# EAGLE board Controller Board (EAGLE 8.5.1), part 1 of 2
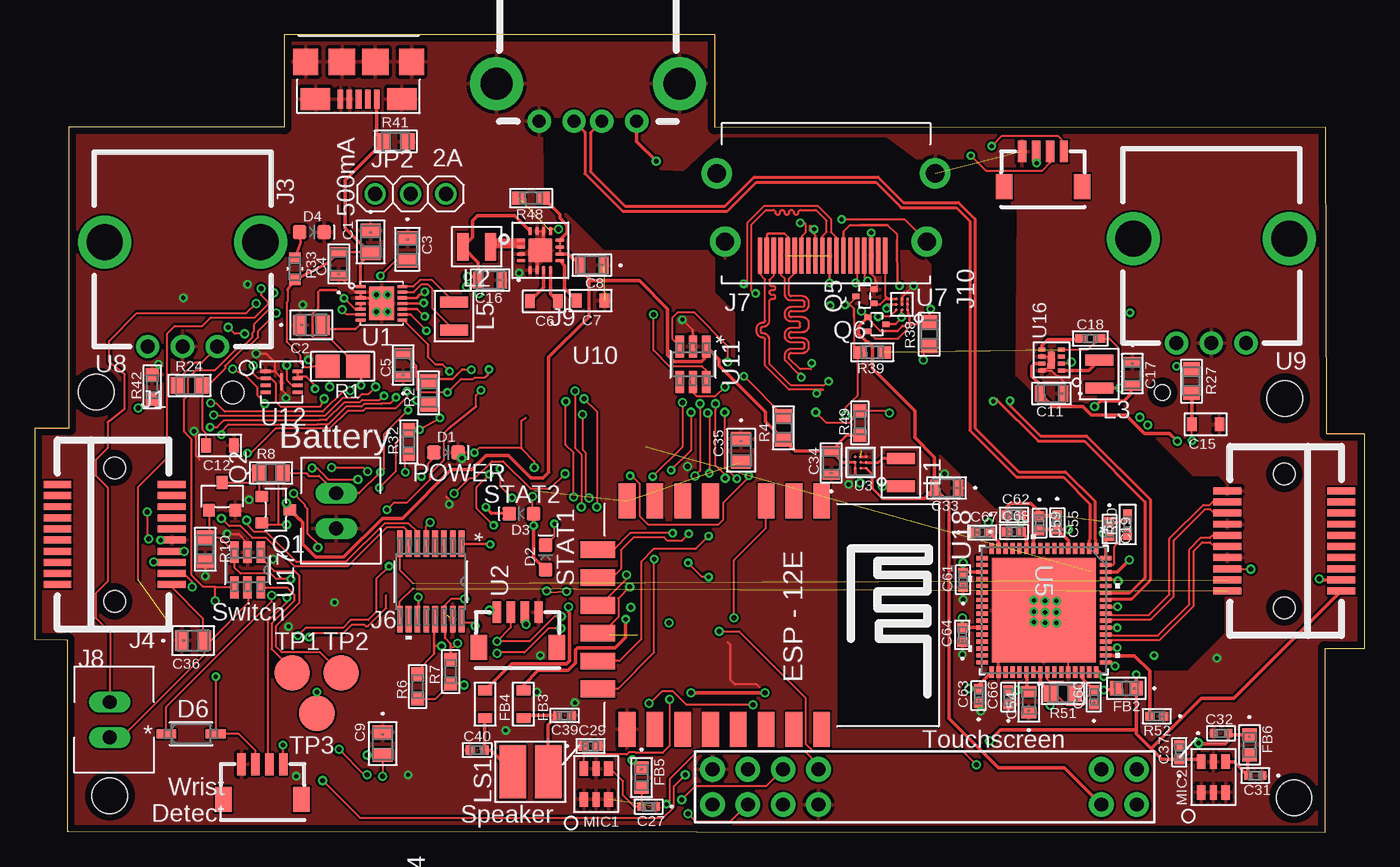
[diagram p6: board, top side]
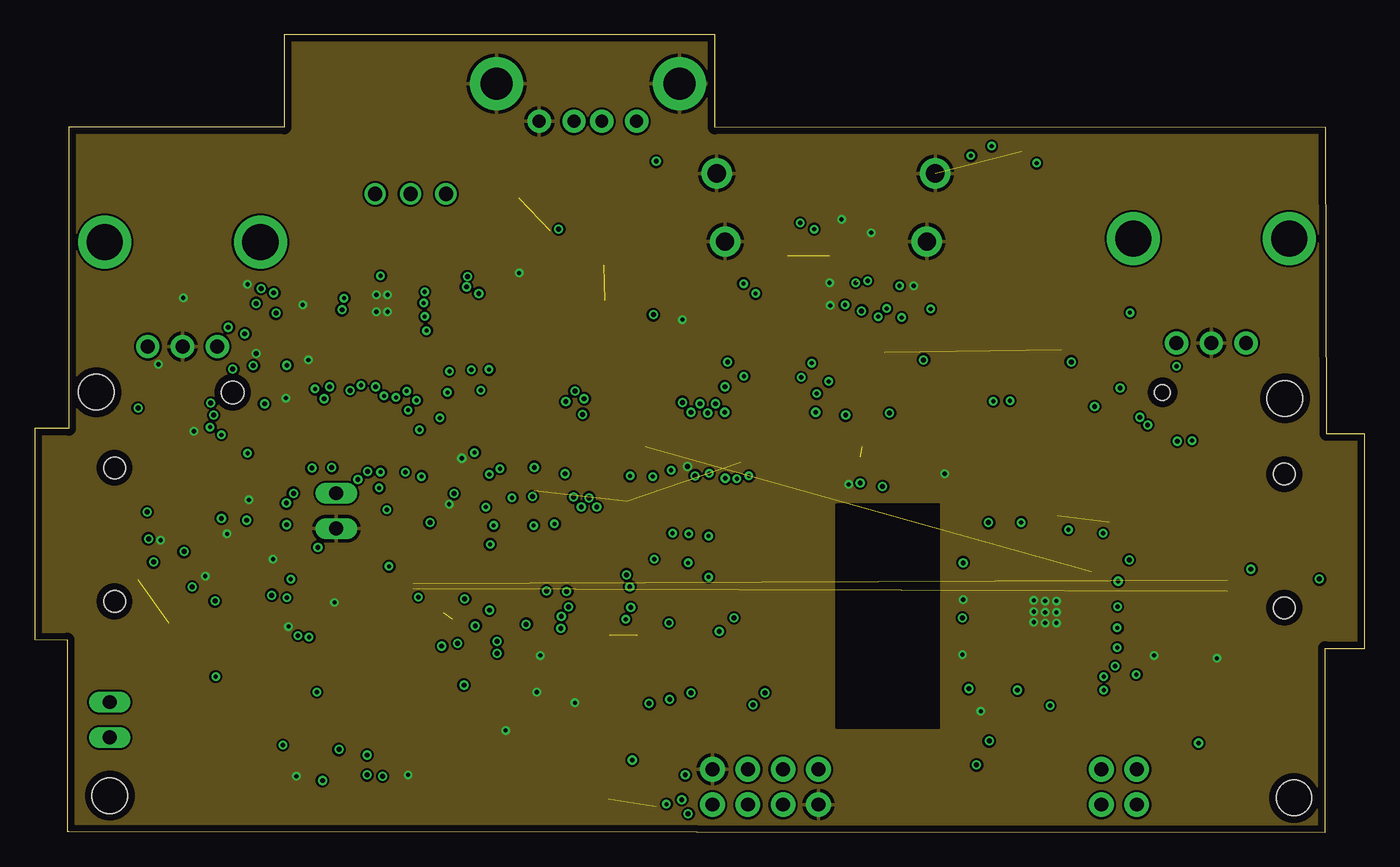
[diagram p7: board, inner layer Route2]
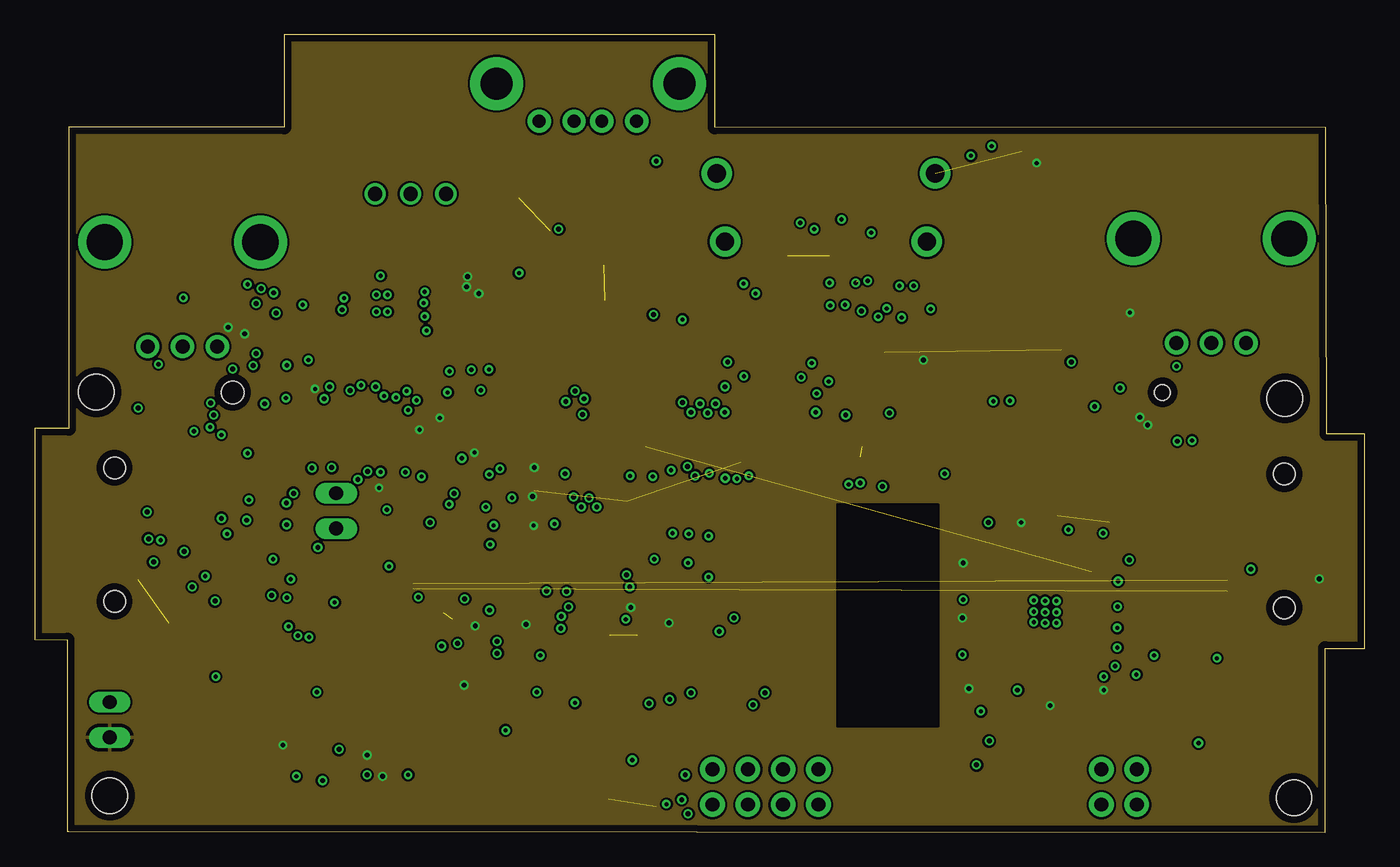
[diagram p8: board, inner layer Route15]
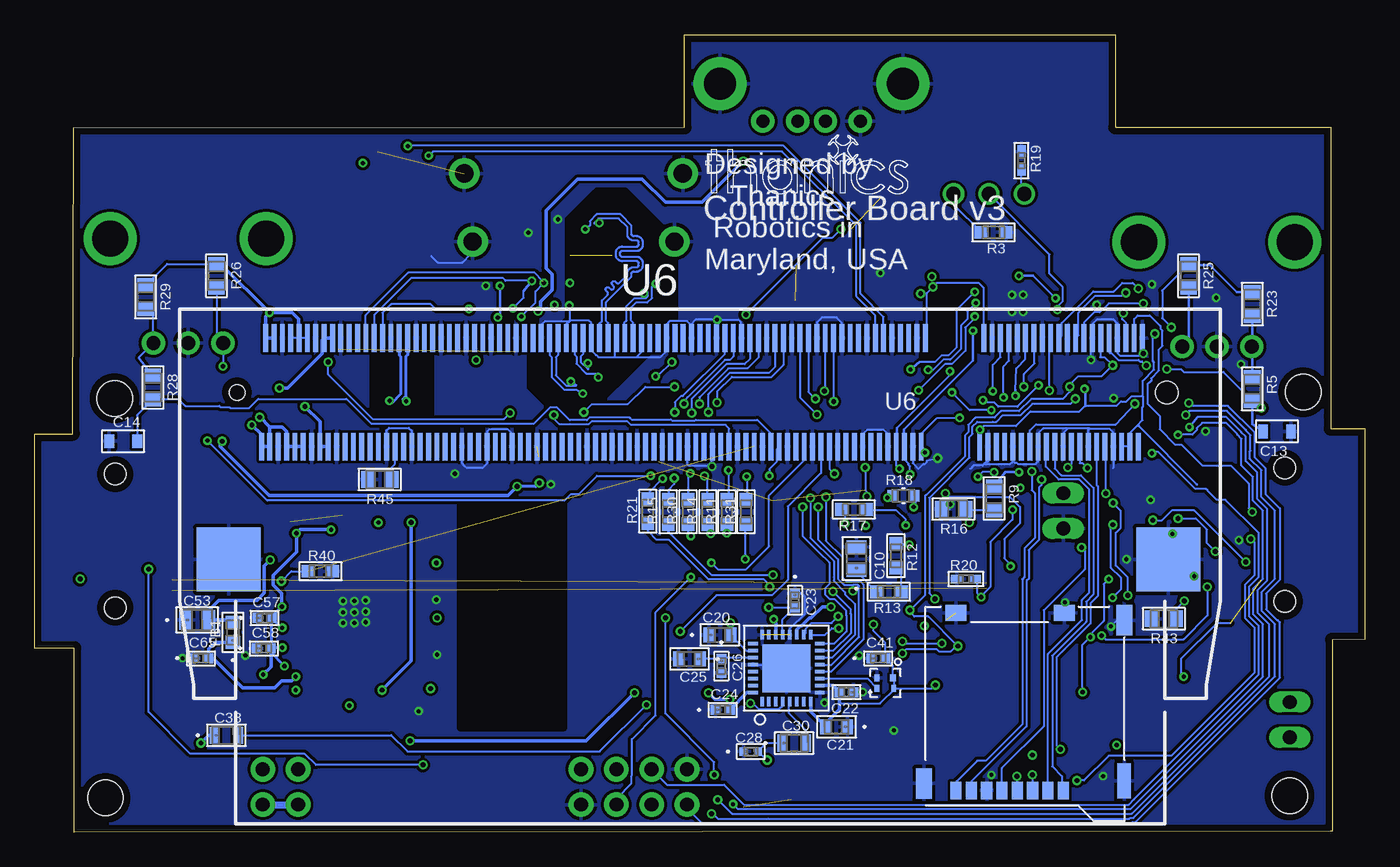
[diagram p9: board, bottom side, seen from below]

Size 95.55 x 57.3 mm. Coordinates in mm from the lower left corner, seen from the top.
Outline: 2.45,0.08 92.71,0 92.71,13.21 95.55,13.21 95.55,28.63 92.81,28.63 92.76,50.62 48.87,50.65 48.87,57.3 17.93,57.3 17.93,50.65 2.45,50.65 2.44,29.87 2.44,29.01 0,29.01 0,13.84 2.34,13.82 2.34,0.08 2.45,0.08
Copper layers (1*2*15*16): Top 0.035mm / dielectric 0.2mm / Route2 0.035mm / dielectric 1.2mm / Route15 0.035mm / dielectric 0.2mm / Bottom 0.035mm
Design rules "Elecrow_4-layer_PCB_eagle_rule *": minimum track width 6mil, minimum drill 12mil, track to track 6mil, track to pad 6mil, pad to pad 6mil, via to via 8mil, smd to smd 0mil, copper to edge 20mil, drill to drill 10mil, minimum pad ring 6mil, minimum via ring 6mil, stop-mask expansion 0mil, vias tented up to drill 100mil, thermal gap 10mil
Holes 2.54 mm at 90.47,2.46 5.38,2.62 89.81,31.17 4.42,31.62

## Footprints (pad centres in the part's own frame; a part is rotated, then mirrored left to right if it is on the bottom)
0805 = smd 0.965 x 1.448: 1 -0.826,0; 2 0.826,0
YAG_CC0805 = smd 0.965 x 1.448: 1 -0.826,0; 2 0.826,0
G-21 = smd 0.711 x 1.245: 1 -0.851,0; 2 0.851,0
0603_CAPACITOR = smd 0.701 x 1.001: 1 -1.001,0; 2 1.001,0
CC0402N-M = smd 0.864 x 0.61: 1 -0.635,0; 2 0.635,0
0402-M = smd 0.711 x 0.711: 1 -0.508,0; 2 0.508,0
0603-M = smd 0.813 x 1.067: 1 -0.775,0; 2 0.775,0
G-155-M = smd 0.559 x 0.61: 1 -0.521,0; 2 0.521,0
YAG_CC0402-M = smd 0.61 x 0.66: 1 -0.521,0; 2 0.521,0
LED-0603 = smd 1 x 1: A -0.877,0; C 0.877,0
SOD123-M = smd 1.416 x 0.652: A 1.776,0; C -1.776,0
IND_BLM18_0603-M = smd 0.914 x 1.041: 1 -0.724,0; 2 0.724,0
JST_SH_4POS = smd 0.6 x 1.55: 1 -1.5,0; 2 -0.5,0; 3 0.5,0; 4 1.5,0 | smd 1.2 x 1.8: P$5 -2.8,2.525; P$6 2.8,2.525
3.5_TOUCHSCREEN = drill 1 pad 1.778: 1 -12.7,1.27; 2 -10.16,1.27; 3 10.16,1.27; 4 12.7,1.27; 5 15.24,1.27; 6 17.78,1.27; 7 17.78,-1.27; 8 15.24,-1.27; 9 12.7,-1.27; 10 10.16,-1.27; 11 -10.16,-1.27; 12 -12.7,-1.27
USB_MICRO_B_SMT = smd 0.4 x 1.35: 1 -1.3,0; 2 -0.65,0; 3 0,0; 4 0.65,0; 5 1.3,0 | smd 1.9 x 1.9: 6 -1.2,-2.68; 7 1.2,-2.68 | smd 2.1 x 1.6: P$1 -3.1,0; P$2 3.1,0 | smd 1.8 x 1.9: P$3 3.8,-2.68; P$4 -3.8,-2.68
EDGE_CONNECTOR_20POS = smd 0.5 x 2: 1 -3.6,0; 2 -2.8,0; 3 -2,0; 4 -1.2,0; 5 -0.4,0; 6 0.4,0; 7 1.2,0; 8 2,0; 9 2.8,0; 10 3.6,0; 11 3.6,8.2; 12 2.8,8.2; 13 2,8.2; 14 1.2,8.2; 15 0.4,8.2; 16 -0.4,8.2; 17 -1.2,8.2; 18 -2,8.2; 19 -2.8,8.2; 20 -3.6,8.2 | hole 1.55: -4.8,4.1; 4.8,4.1
XH_CONNECTOR = drill 1.001 long: 1 -1.27,0; 2 1.27,0
HDMI = smd 0.3 x 2.6: 1 4.75,4; 2 4.25,4; 3 3.75,4; 4 3.25,4; 5 2.75,4; 6 2.25,4; 7 1.75,4; 8 1.25,4; 9 0.75,4; 10 0.25,4; 11 -0.25,4; 12 -0.75,4; 13 -1.25,4; 14 -1.75,4; 15 -2.25,4; 16 -2.75,4; 17 -3.25,4; 18 -3.75,4; 19 -4.25,4 | drill 1.3 pad 2.184: P$1 7.25,3; P$2 -7.25,3; P$3 -7.85,-1.9; P$4 7.85,-1.9
USB_A_RECEPT = drill 0.92 pad 1.676: 1 -3.5,0; 2 -1,0; 3 1,0; 4 3.5,0 | drill 2.3 pad 3.81: 5 -6.57,-2.71; 6 6.57,-2.71
1X03 = drill 1.016: 1 -2.54,0; 2 0,0; 3 2.54,0
1008 = smd 0.8 x 2: P$1 -1,0; P$2 1,0
470NH_INDUCTOR = smd 0.8 x 2: P$1 -1,0; P$2 1,0
SPEAKER = smd 1.905 x 3.81: 1 -1.27,0.889; 2 1.27,0.889
SISONIC_MICROPHONE = smd 1.032 x 0.622: 1 -1.104,0.884; 3 -1.104,-0.884; 4 1.104,-0.884; 6 1.104,0.884 | smd 1.032 x 0.5: 2 -1.104,0; 5 1.104,0
SOT-23_(TO-236AB) = smd 0.8 x 0.9: D 0,-1; G 0.95,1; S -0.95,1
SOT-523 = smd 0.4 x 0.51: D 0,0.65; G -0.5,-0.65; S 0.5,-0.65
1206 = smd 1.727 x 1.676: 1 -1.092,0; 2 1.092,0
RC0805N = smd 1.006 x 1.2: 1 -0.853,0; 2 0.853,0
RC0603N-M = smd 0.965 x 0.914: 1 -0.876,0; 2 0.876,0
RC0603N = smd 0.762 x 0.813: 1 -0.775,0; 2 0.775,0
RC0402N-M = smd 0.864 x 0.61: 1 -0.66,0; 2 0.66,0
YAG_R0402-M = smd 0.66 x 0.66: 1 -0.508,0; 2 0.508,0
B2,54 = smd 2.54 x 2.54: TP 0,0
AAT3620_TDFN = smd 0.7 x 0.22: 1 -1.5,1.2; 2 -1.5,0.8; 3 -1.5,0.4; 4 -1.5,0; 5 -1.5,-0.4; 6 -1.5,-0.8; 7 -1.5,-1.2; 8 1.5,-1.2; 9 1.5,-0.8; 10 1.5,-0.4; 11 1.5,0; 12 1.5,0.4; 13 1.5,0.8; 14 1.5,1.2 | smd 1.8 x 2.4: EP 0,0
21-0055H_16-M = smd 1.905 x 0.406: 1 -2.705,2.223; 2 -2.705,1.587; 3 -2.705,0.953; 4 -2.705,0.318; 5 -2.705,-0.318; 6 -2.705,-0.953; 7 -2.705,-1.587; 8 -2.705,-2.223; 9 2.705,-2.223; 10 2.705,-1.587; 11 2.705,-0.953; 12 2.705,-0.318; 13 2.705,0.318; 14 2.705,0.953; 15 2.705,1.587; 16 2.705,2.223
YFF9 = smd 0.23 x 0.23: A1 -0.4,0.4; A2 0,0.4; A3 0.4,0.4; B1 -0.4,0; B2 0,0; B3 0.4,0; C1 -0.4,-0.4; C2 0,-0.4; C3 0.4,-0.4
QFN64_9X9MC-M = smd 0.813 x 0.305: 1 -4.445,3.75; 2 -4.445,3.25; 3 -4.445,2.75; 4 -4.445,2.25; 5 -4.445,1.75; 6 -4.445,1.25; 7 -4.445,0.75; 8 -4.445,0.25; 9 -4.445,-0.25; 10 -4.445,-0.75; 11 -4.445,-1.25; 12 -4.445,-1.75; 13 -4.445,-2.25; 14 -4.445,-2.75; 15 -4.445,-3.25; 16 -4.445,-3.75; 33 4.445,-3.75; 34 4.445,-3.25; 35 4.445,-2.75; 36 4.445,-2.25; 37 4.445,-1.75; 38 4.445,-1.25; 39 4.445,-0.75; 40 4.445,-0.25; 41 4.445,0.25; 42 4.445,0.75; 43 4.445,1.25; 44 4.445,1.75; 45 4.445,2.25; 46 4.445,2.75; 47 4.445,3.25; 48 4.445,3.75 | smd 0.305 x 0.813: 17 -3.75,-4.445; 18 -3.25,-4.445; 19 -2.75,-4.445; 20 -2.25,-4.445; 21 -1.75,-4.445; 22 -1.25,-4.445; 23 -0.75,-4.445; 24 -0.25,-4.445; 25 0.25,-4.445; 26 0.75,-4.445; 27 1.25,-4.445; 28 1.75,-4.445; 29 2.25,-4.445; 30 2.75,-4.445; 31 3.25,-4.445; 32 3.75,-4.445; 49 3.75,4.445; 50 3.25,4.445; 51 2.75,4.445; 52 2.25,4.445; 53 1.75,4.445; 54 1.25,4.445; 55 0.75,4.445; 56 0.25,4.445; 57 -0.25,4.445; 58 -0.75,4.445; 59 -1.25,4.445; 60 -1.75,4.445; 61 -2.25,4.445; 62 -2.75,4.445; 63 -3.25,4.445; 64 -3.75,4.445 | smd 7.493 x 7.493: 65 0,0
SO-DIMM = smd 0.35 x 2: 1 -26.4,-3.9; 2 -26.1,3.9; 3 -25.8,-3.9; 4 -25.5,3.9; 5 -25.2,-3.9; 6 -24.9,3.9; 7 -24.6,-3.9; 8 -24.3,3.9; 9 -24,-3.9; 10 -23.7,3.9; 11 -23.4,-3.9; 12 -23.1,3.9; 13 -22.8,-3.9; 14 -22.5,3.9; 15 -22.2,-3.9; 16 -21.9,3.9; 17 -21.6,-3.9; 18 -21.3,3.9; 19 -21,-3.9; 20 -20.7,3.9; 21 -20.4,-3.9; 22 -20.1,3.9; 23 -19.8,-3.9; 24 -19.5,3.9; 25 -19.2,-3.9; 26 -18.9,3.9; 27 -18.6,-3.9; 28 -18.3,3.9; 29 -18,-3.9; 30 -17.7,3.9; 31 -17.4,-3.9; 32 -17.1,3.9; 33 -16.8,-3.9; 34 -16.5,3.9; 35 -16.2,-3.9; 36 -15.9,3.9; 37 -15.6,-3.9; 38 -15.3,3.9; 39 -15,-3.9; 40 -14.7,3.9; 41 -10.8,-3.9; 42 -10.5,3.9; 43 -10.2,-3.9; 44 -9.9,3.9; 45 -9.6,-3.9; 46 -9.3,3.9; 47 -9,-3.9; 48 -8.7,3.9; 49 -8.4,-3.9; 50 -8.1,3.9; 51 -7.8,-3.9; 52 -7.5,3.9; 53 -7.2,-3.9; 54 -6.9,3.9; 55 -6.6,-3.9; 56 -6.3,3.9; 57 -6,-3.9; 58 -5.7,3.9; 59 -5.4,-3.9; 60 -5.1,3.9; 61 -4.8,-3.9; 62 -4.5,3.9; 63 -4.2,-3.9; 64 -3.9,3.9; 65 -3.6,-3.9; 66 -3.3,3.9; 67 -3,-3.9; 68 -2.7,3.9; 69 -2.4,-3.9; 70 -2.1,3.9; 71 -1.8,-3.9; 72 -1.5,3.9; 73 -1.2,-3.9; 74 -0.9,3.9; 75 -0.6,-3.9; 76 -0.3,3.9; 77 0,-3.9; 78 0.3,3.9; 79 0.6,-3.9; 80 0.9,3.9; 81 1.2,-3.9; 82 1.5,3.9; 83 1.8,-3.9; 84 2.1,3.9; 85 2.4,-3.9; 86 2.7,3.9; 87 3,-3.9; 88 3.3,3.9; 89 3.6,-3.9; 90 3.9,3.9; 91 4.2,-3.9; 92 4.5,3.9; 93 4.8,-3.9; 94 5.1,3.9; 95 5.4,-3.9; 96 5.7,3.9; 97 6,-3.9; 98 6.3,3.9; 99 6.6,-3.9; 100 6.9,3.9; 101 7.2,-3.9; 102 7.5,3.9; 103 7.8,-3.9; 104 8.1,3.9; 105 8.4,-3.9; 106 8.7,3.9; 107 9,-3.9; 108 9.3,3.9; 109 9.6,-3.9; 110 9.9,3.9; 111 10.2,-3.9; 112 10.5,3.9; 113 10.8,-3.9; 114 11.1,3.9; 115 11.4,-3.9; 116 11.7,3.9; 117 12,-3.9; 118 12.3,3.9; 119 12.6,-3.9; 120 12.9,3.9; 121 13.2,-3.9; 122 13.5,3.9; 123 13.8,-3.9; 124 14.1,3.9; 125 14.4,-3.9; 126 14.7,3.9; 127 15,-3.9; 128 15.3,3.9; 129 15.6,-3.9; 130 15.9,3.9; 131 16.2,-3.9; 132 16.5,3.9; 133 16.8,-3.9; 134 17.1,3.9; 135 17.4,-3.9; 136 17.7,3.9; 137 18,-3.9; 138 18.3,3.9; 139 18.6,-3.9; 140 18.9,3.9; 141 19.2,-3.9; 142 19.5,3.9; 143 19.8,-3.9; 144 20.1,3.9; 145 20.4,-3.9; 146 20.7,3.9; 147 21,-3.9; 148 21.3,3.9; 149 21.6,-3.9; 150 21.9,3.9; 151 22.2,-3.9; 152 22.5,3.9; 153 22.8,-3.9; 154 23.1,3.9; 155 23.4,-3.9; 156 23.7,3.9; 157 24,-3.9; 158 24.3,3.9; 159 24.6,-3.9; 160 24.9,3.9; 161 25.2,-3.9; 162 25.5,3.9; 163 25.8,-3.9; 164 26.1,3.9; 165 26.4,-3.9; 166 26.7,3.9; 167 27,-3.9; 168 27.3,3.9; 169 27.6,-3.9; 170 27.9,3.9; 171 28.2,-3.9; 172 28.5,3.9; 173 28.8,-3.9; 174 29.1,3.9; 175 29.4,-3.9; 176 29.7,3.9; 177 30,-3.9; 178 30.3,3.9; 179 30.6,-3.9; 180 30.9,3.9; 181 31.2,-3.9; 182 31.5,3.9; 183 31.8,-3.9; 184 32.1,3.9; 185 32.4,-3.9; 186 32.7,3.9; 187 33,-3.9; 188 33.3,3.9; 189 33.6,-3.9; 190 33.9,3.9; 191 34.2,-3.9; 192 34.5,3.9; 193 34.8,-3.9; 194 35.1,3.9; 195 35.4,-3.9; 196 35.7,3.9; 197 36,-3.9; 198 36.3,3.9; 199 36.6,-3.9; 200 36.9,3.9 | smd 4.6 x 4.6: G1 -28.254,12; G2 39.27,12 | hole 1.6: -28.15,0 | hole 1.1: 38.65,0
WLCSP9 = smd 0.23 x 0.23: A1 -0.4,0.4; A2 0,0.4; A3 0.4,0.4; B1 -0.4,0; B2 0,0; B3 0.4,0; C1 -0.4,-0.4; C2 0,-0.4; C3 0.4,-0.4
PEC12R = drill 2.6 pad 3.81: 1 -5.6,7.5; 2 5.6,7.5 | drill 1 pad 1.676: A -2.5,0; B 2.5,0; C 0,0
VQFN16 = smd 0.6 x 0.24: 1 -1.4,0.75; 2 -1.4,0.25; 3 -1.4,-0.25; 4 -1.4,-0.75; 9 1.4,-0.75; 10 1.4,-0.25; 11 1.4,0.25; 12 1.4,0.75 | smd 0.24 x 0.6: 5 -0.75,-1.4; 6 -0.25,-1.4; 7 0.25,-1.4; 8 0.75,-1.4; 13 0.75,1.4; 14 0.25,1.4; 15 -0.25,1.4; 16 -0.75,1.4 | smd 1.68 x 1.68: 17 0,0
MF06A-M = smd 1.575 x 0.584: 1 -1.27,0.953; 2 -1.27,0; 3 -1.27,-0.953; 4 1.27,-0.953; 5 1.27,0; 6 1.27,0.953
PG-USON-8-1 = smd 0.7 x 0.25: 1 -1.15,0.75; 2 -1.15,0.25; 3 -1.15,-0.25; 4 -1.15,-0.75; 5 1.15,-0.75; 6 1.15,-0.25; 7 1.15,0.25; 8 1.15,0.75 | smd 0.2 x 1.2: 9 0,0
MLF(ML)_8PIN = smd 0.5 x 0.3: 1 -0.7,0.75; 2 -0.7,0.25; 3 -0.7,-0.25; 4 -0.7,-0.75; 5 0.7,-0.75; 6 0.7,-0.25; 7 0.7,0.25; 8 0.7,0.75 | smd 0.5 x 1.2: EP 0,0
6ST1-M = smd 1.575 x 0.61: 1 -1.27,0.95; 2 -1.27,0; 3 -1.27,-0.95; 4 1.27,-0.95; 5 1.27,0; 6 1.27,0.95
ESP12E-SMD = smd 2.5 x 1.2: ADC -8.3,3.8; CH_PD -8.3,1.8; GND 8.1,-8.2; GPIO0 8.1,-2.2; GPIO2 8.1,-4.2; GPIO4 8.1,-0.2; GPIO5 8.1,1.8; GPIO12 -8.3,-4.2; GPIO13 -8.3,-6.2; GPIO14 -8.3,-2.2; GPIO15 8.1,-6.2; RESET -8.3,5.8; RXD0 8.1,3.8; TXD0 8.1,5.8; VCC -8.3,-8.2 | smd 1.2 x 2.5: CS0 -4.8,-10.3; GPIO9 -0.8,-10.3; GPIO10 1.2,-10.3; MISO -2.8,-10.3; MOSI 3.2,-10.3; SCLK 5.2,-10.3
32QFN = smd 0.7 x 0.25: 1 -2.4,1.75; 2 -2.4,1.25; 3 -2.4,0.75; 4 -2.4,0.25; 5 -2.4,-0.25; 6 -2.4,-0.75; 7 -2.4,-1.25; 8 -2.4,-1.75; 17 2.4,-1.75; 18 2.4,-1.25; 19 2.4,-0.75; 20 2.4,-0.25; 21 2.4,0.25; 22 2.4,0.75; 23 2.4,1.25; 24 2.4,1.75 | smd 0.25 x 0.7: 9 -1.75,-2.4; 10 -1.25,-2.4; 11 -0.75,-2.4; 12 -0.25,-2.4; 13 0.25,-2.4; 14 0.75,-2.4; 15 1.25,-2.4; 16 1.75,-2.4; 25 1.75,2.4; 26 1.25,2.4; 27 0.75,2.4; 28 0.25,2.4; 29 -0.25,2.4; 30 -0.75,2.4; 31 -1.25,2.4; 32 -1.75,2.4 | smd 3.45 x 3.45: EP 0,0
MICROSD = smd 0.8 x 1.24: 1 -4.4,0; 2 -3.3,0; 3 -2.2,0; 4 -1.1,0; 5 0,0; 6 1.1,0; 7 2.2,0; 8 3.3,0 | smd 0.95 x 2.5: 9 -8.775,-0.7 | smd 1.15 x 2.2: 10 5.615,-0.5; 11 -8.775,-12.23 | smd 1.5 x 1.15: 12 -4.47,-12.755; 13 3.31,-12.775
4-VFLGA = smd 0.43 x 0.5: 1 -0.56,-0.375 | smd 0.35 x 0.5: 2 0.6,-0.375; 3 0.6,0.375; 4 -0.6,0.375

## Placement (x,y rotation side)
C1  0.1uF  [0805]  24.13,42.42 270 top
C2  0.1uF  [0805]  19.86,36.45 0 top
C3  1uF  [YAG_CC0805]  26.77,41.88 270 top
C4  10uF  [G-21]  21.84,40.84 90 top
C5  22uF  [G-21]  26.47,33.58 90 top
C6  10nF  [0603_CAPACITOR]  36.58,38.15 180 top
C7  10nF  [0603_CAPACITOR]  39.93,38.2 180 top
C8  10uF  [G-21]  40.03,40.74 180 top
C9  0.1uF  [0805]  24.99,6.35 270 top
C10  0.1uF  [0805]  36.53,19.66 90 bottom
C11  10uF  [G-21]  73.05,31.52 180 top
C12  10nF  [0603_CAPACITOR]  13.31,27.79 180 top
C13  10nF  [0603_CAPACITOR]  6.3,28.8 180 bottom
C14  10nF  [0603_CAPACITOR]  89.2,28.09 0 bottom
C15  10nF  [0603_CAPACITOR]  84.12,29.31 180 top
C16  22uF  [G-21]  32.72,39.67 180 top
C17  10uF  [G-21]  78.87,32.94 270 top
C18  560pF  [CC0402N-M]  75.84,35.48 0 top
C19  0.1uF  [0402-M]  77.22,21.79 270 top
C20  4.7uF  [0603-M]  46.33,14.17 0 bottom
C21  4.7uF  [0603-M]  37.95,7.57 180 bottom
C22  0.1uF  [0402-M]  37.24,10.06 180 bottom
C23  0.1uF  [0402-M]  40.94,16.66 270 bottom
C24  0.1uF  [0402-M]  46.13,8.79 0 bottom
C25  4.7uF  [0603-M]  48.51,12.45 180 bottom
C26  0.1uF  [0402-M]  46.23,11.94 270 bottom
C27  33pF  [G-155-M]  44.11,1.83 180 top
C28  33pF  [G-155-M]  44.11,5.79 0 bottom
C29  0.1uF  [0402-M]  39.93,6.2 0 top
C30  10uF  [G-21]  41,6.4 0 bottom
C31  33pF  [G-155-M]  87.69,4.06 180 top
C32  33pF  [G-155-M]  85.23,7.11 0 top
C33  10uF  [G-21]  65.51,24.74 180 top
C34  10uF  [G-21]  57.23,26.54 90 top
C35  0.1uF  [0805]  50.75,27.43 270 top
C36  0.1uF  [0805]  11.38,13.77 0 top
C37  0.1uF  [0402-M]  82.25,5.74 90 top
C38  10uF  [G-21]  81.79,6.96 0 bottom
C39  100pF  [YAG_CC0402-M]  38.06,8.38 180 top
C40  100pF  [YAG_CC0402-M]  31.79,5.89 0 top
C41  0.1uF  [0402-M]  34.95,12.5 0 bottom
C53  1uF  [YAG_CC0805]  83.89,15.25 0 bottom
C54  4.7uF  [0603-M]  71.42,9.35 90 top
C55  0.1uF  [0402-M]  73.46,22.25 270 top
C57  0.1uF  [0402-M]  79.04,15.39 0 bottom
C58  0.1uF  [0402-M]  79.1,13.21 0 bottom
C59  0.1uF  [0402-M]  72.19,22.2 270 top
C60  0.1uF  [0402-M]  76.1,9.7 90 top
C61  0.1uF  [0402-M]  66.7,18.14 90 top
C62  0.1uF  [0402-M]  70.36,22.81 0 top
C63  0.1uF  [0402-M]  67.82,9.8 90 top
C64  0.1uF  [0402-M]  66.65,14.17 90 top
C65  0.1uF  [0402-M]  83.62,12.5 0 bottom
C66  0.1uF  [0402-M]  69.95,9.7 90 top
C67  0.1uF  [0402-M]  68.07,21.54 0 top
C68  0.1uF  [0402-M]  70.36,21.59 0 top
D1  GREEN  [LED-0603]  29.54,27.28 0 top
D2  GREEN  [LED-0603]  36.7,19.75 90 top
D3  GREEN  [LED-0603]  34.96,22.89 180 top
D4  GREEN  [LED-0603]  19.91,43.13 0 top
D6  [SOD123-M]  11.23,7.06 0 top
FB1  600R  [IND_BLM18_0603-M]  81.32,14.36 90 bottom
FB2  600R  [IND_BLM18_0603-M]  78.43,10.34 180 top
FB3  CIM10J121NC  [0603_CAPACITOR]  35.1,9.19 270 top
FB4  CIM10J121NC  [0603_CAPACITOR]  32.36,9.19 270 top
FB5  2.5k  [IND_BLM18_0603-M]  43.59,3.92 270 top
FB6  2.5k  [IND_BLM18_0603-M]  87.27,6.26 270 top
J1  [JST_SH_4POS]  72.44,48.92 180 top
J2  3.5_TOUCHSCREEN  [3.5_TOUCHSCREEN]  66.47,3.25 180 top
J3  USB_MICRO_B_SMT  [USB_MICRO_B_SMT]  23.27,52.68 180 top
J4  [JST_SH_4POS]  16.36,4.88 180 top
J5  EDGE_CONNECTOR_20POS  [EDGE_CONNECTOR_20POS]  1.63,21.39 270 top
J6  POWER_CONNECTOR  [XH_CONNECTOR]  21.67,23.09 270 top
J7  HDMI  [HDMI]  56.85,45.44 180 top
J8  2_PIN_CONNECTOR  [XH_CONNECTOR]  5.38,8.08 270 top
J9  USB_A_RECEPT  [USB_A_RECEPT]  39.74,51.09 180 top
J10  EDGE_CONNECTOR_20POS  [EDGE_CONNECTOR_20POS]  93.88,20.93 90 top
J11  [JST_SH_4POS]  34.7,15.8 180 top
JP2  [1X03]  27,45.87 180 top
L1  4.7uH  [1008]  62.23,25.86 270 top
L2  470nH  [470NH_INDUCTOR]  31.75,42.06 180 top
L3  470nH  [470NH_INDUCTOR]  76.48,32.92 270 top
L5  4.7uH  [1008]  30.12,37.08 270 top
LS1  [SPEAKER]  35.61,5.23 180 top
MIC1  [SISONIC_MICROPHONE]  40.34,3.45 90 top
MIC2  [SISONIC_MICROPHONE]  84.68,3.96 90 top
Q1  [SOT-23_(TO-236AB)]  17.32,23.16 90 top
Q2  2N7002P_MOSFET  [SOT-23_(TO-236AB)]  13.46,24.13 180 top
Q5  [SOT-523]  59.64,38.51 90 top
Q6  [SOT-523]  60.5,36.5 270 top
R1  100  [1206]  22.12,33.48 180 top
R2  10k  [RC0805N]  28.3,31.57 90 top
R3  100k  [RC0603N-M]  26.67,43.1 180 bottom
R4  10k  [RC0805N]  53.8,29.06 90 top
R5  10k  [RC0805N]  8.08,31.85 270 bottom
R6  1k  [RC0603N-M]  27.51,10.46 90 top
R7  1k  [RC0603N-M]  29.87,11.53 90 top
R8  10k  [RC0805N]  16.97,25.81 0 top
R9  10k  [RC0805N]  26.62,23.98 270 bottom
R10  10k  [RC0805N]  12.24,20.32 270 top
R11  20R  [RC0603N-M]  45.82,23.01 90 bottom
R12  1k  [RC0603N-M]  33.68,19.86 270 bottom
R13  1k  [RC0603N-M]  34.19,17.27 180 bottom
R14  20R  [RC0603N-M]  47.19,23.01 90 bottom
R15  20R  [RC0603N-M]  50.04,23.01 90 bottom
R16  10k  [RC0805N]  29.54,23.22 180 bottom
R17  20R  [RC0603N-M]  36.7,23.19 180 bottom
R18  340R  [RC0603N]  33.15,24.18 0 bottom
R19  24.9k  [RC0402N-M]  24.66,48.26 270 bottom
R20  24.9k  [RC0402N-M]  28.65,18.19 0 bottom
R21  20R  [RC0603N-M]  51.51,23.06 90 bottom
R23  10k  [RC0805N]  8.08,37.95 270 bottom
R24  10k  [RC0805N]  11.13,32.11 0 top
R25  10k  [RC0805N]  12.65,39.98 270 bottom
R26  10k  [RC0805N]  82.5,39.98 270 bottom
R27  10k  [RC0805N]  83.11,32.41 270 top
R28  10k  [RC0805N]  87.07,31.95 270 bottom
R29  10k  [RC0805N]  87.58,38.46 270 bottom
R30  20R  [RC0603N-M]  48.62,23.01 90 bottom
R31  20R  [RC0603N-M]  44.45,23.01 90 bottom
R32  20R  [RC0603N-M]  26.87,28.04 90 top
R33  340R  [RC0603N]  18.69,40.49 270 top
R38  NF  [RC0805N]  64.26,35.79 90 top
R39  100k  [RC0603N-M]  60.17,34.49 180 top
R40  100k  [RC0603N-M]  75.03,18.75 0 bottom
R41  10k  [RC0805N]  25.93,49.63 0 top
R42  100k  [RC0603N-M]  8.43,32 90 top
R43  10k  [RC0805N]  14.43,15.34 180 bottom
R45  10k  [RC0805N]  70.76,25.35 180 bottom
R48  100k  [RC0603N-M]  35.66,45.57 180 top
R49  100k  [RC0603N-M]  59.28,29.41 90 top
R50  12k  [RC0402N-M]  78.51,22.11 90 top
R51  10k  [RC0805N]  73.87,9.97 180 top
R52  12.4k  [YAG_R0402-M]  80.62,8.33 180 top
TP1  TPB2,54  [B2,54]  18.49,11.43 0 top
TP2  TPB2,54  [B2,54]  22,11.43 0 top
TP3  TPB2,54  [B2,54]  20.27,8.53 180 top
U1  AAT3620_BATT_CHARGER  [AAT3620_TDFN]  24.92,38 0 top
U2  8 CH  [21-0055H_16-M]  28.45,18.01 270 top
U3  [YFF9]  59.33,26.57 180 top
U5  [QFN64_9X9MC-M]  72.5,15.95 270 top
U6  [SO-DIMM]  42.37,31.6 180 bottom
U7  ESD5384  [WLCSP9]  62.31,37.92 180 top
U8  PEC12R  [PEC12R]  10.62,34.9 0 top
U9  PEC12R  [PEC12R]  84.53,35.15 0 top
U10  TPS6209  [VQFN16]  36.32,41.81 0 top
U11  LM3880MF-1AA/NOPBMF06A-M  [MF06A-M]  47.29,33.63 270 top
U12  APPLE_2.0C_COPROCESSOR  [PG-USON-8-1]  17.73,32.36 0 top
U16  MIC23050  [MLF(ML)_8PIN]  73.05,33.93 180 top
U17  [6ST1-M]  15.29,18.85 270 top
U18  [ESP12E-SMD]  50.75,15.49 270 top
U19  WM8960  [32QFN]  41.55,11.79 90 bottom
U$2  MICROSD  [MICROSD]  26.06,3 180 bottom
Y1  DSC6001  [4-VFLGA]  34.44,10.72 180 bottom